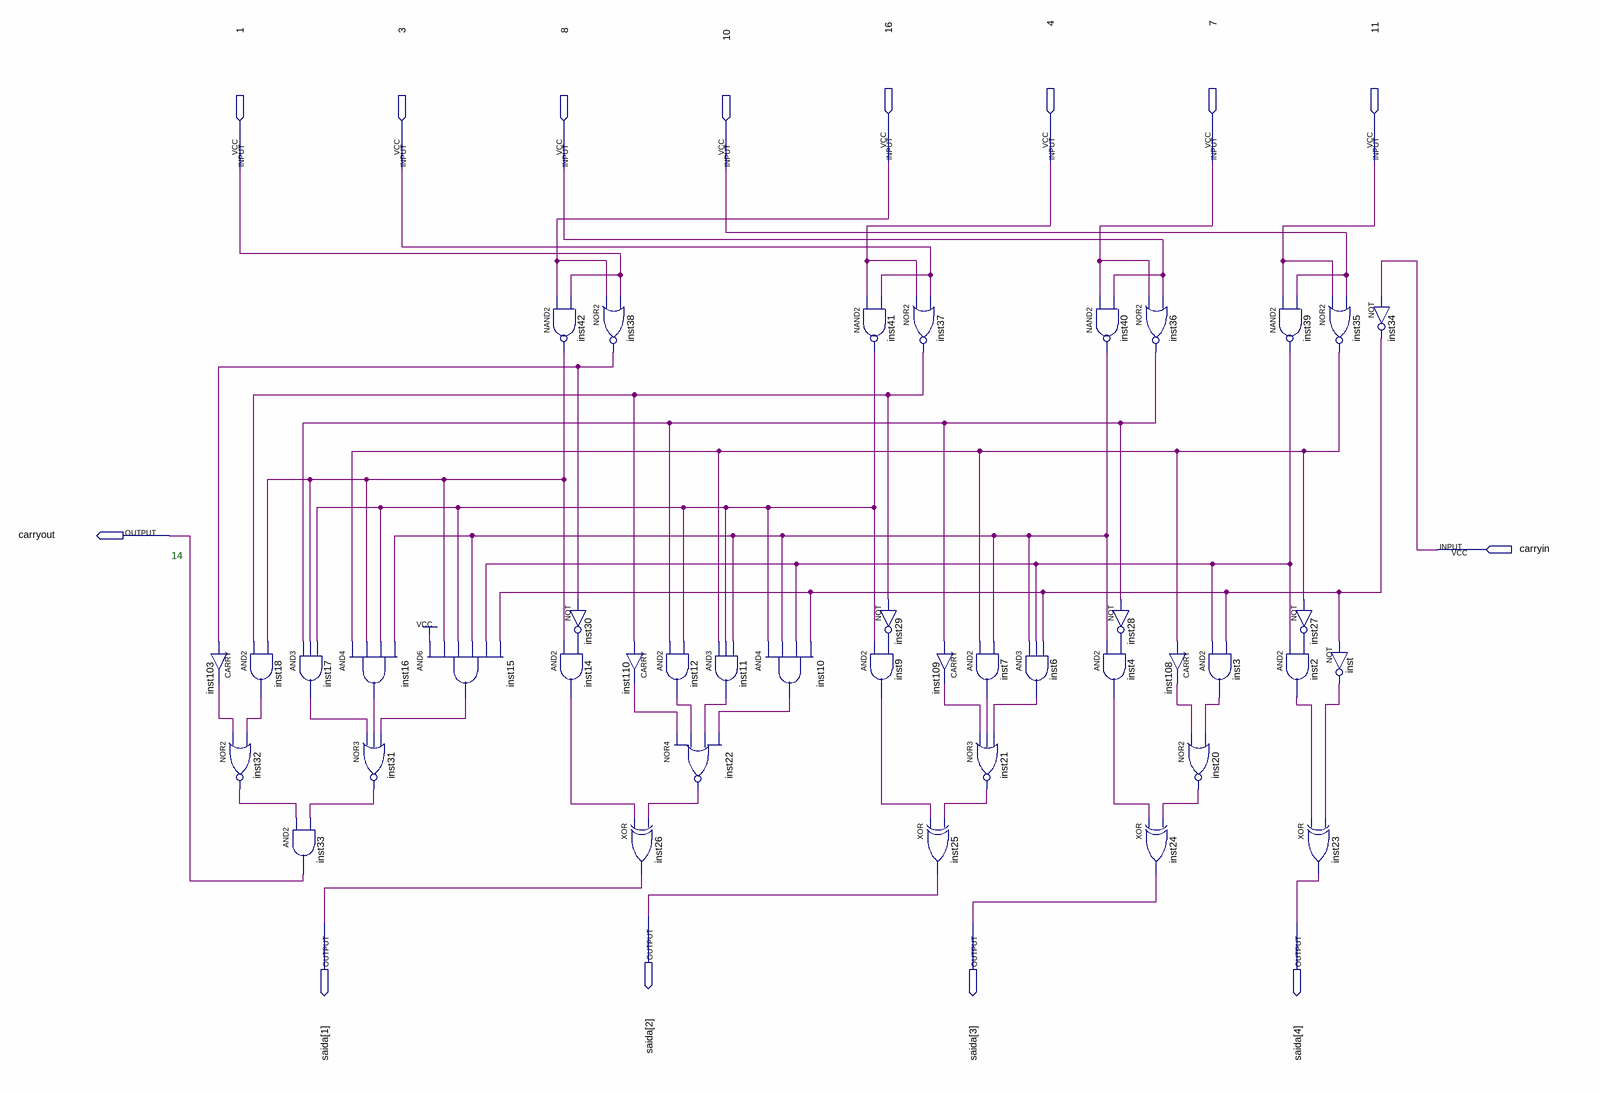
[diagram p0: schematic sheet]
// Quartus schematic adder.bdf as structural Verilog: 42 symbols, 14 pins
module adder (
  input  \16 ,
  input  \4 ,
  input  \7 ,
  input  \11 ,
  input  \1 ,
  input  \3 ,
  input  \8 ,
  input  \10 ,
  input  carryin,
  output carryout,
  output [4:1] saida
);

  wire inst2_out, inst3_out, inst4_out, inst6_out, inst7_out, inst9_out, inst10_out, inst11_out, inst12_out,
       inst14_out, inst15_out, inst16_out, inst17_out, inst18_out, inst20_out, inst21_out, inst22_out,
       inst27_out, inst28_out, inst29_out, inst30_out, inst31_out, inst32_out, inst34_out, inst35_out,
       inst36_out, inst37_out, inst38_out, inst39_out, inst40_out, inst41_out, inst42_out, inst103_out,
       inst108_out, inst109_out, inst110_out, inst_out;

  and inst18 (inst18_out, inst37_out, inst42_out);
  CARRY inst103 (.IN(inst38_out), .OUT(inst103_out));
  nor inst32 (inst32_out, inst103_out, inst18_out);
  and inst17 (inst17_out, inst36_out, inst42_out, inst41_out);
  and inst33 (carryout, inst32_out, inst31_out);
  and inst16 (inst16_out, inst35_out, inst42_out, inst41_out, inst40_out);
  nor inst31 (inst31_out, inst17_out, inst16_out, inst15_out);
  and inst15 (inst15_out, 1'b1, inst42_out, inst41_out, inst40_out, inst39_out, inst34_out);
  nand inst42 (inst42_out, \16 , \1 );
  not inst30 (inst30_out, inst38_out);
  and inst14 (inst14_out, inst42_out, inst30_out);
  nor inst38 (inst38_out, \16 , \1 );
  CARRY inst110 (.IN(inst37_out), .OUT(inst110_out));
  xor inst26 (saida[1], inst14_out, inst22_out);
  and inst12 (inst12_out, inst36_out, inst41_out);
  nor inst22 (inst22_out, inst110_out, inst12_out, inst11_out, inst10_out);
  and inst10 (inst10_out, inst41_out, inst40_out, inst39_out, inst34_out);
  and inst11 (inst11_out, inst35_out, inst41_out, inst40_out);
  nand inst41 (inst41_out, \4 , \3 );
  and inst9 (inst9_out, inst41_out, inst29_out);
  nor inst37 (inst37_out, \4 , \3 );
  not inst29 (inst29_out, inst37_out);
  xor inst25 (saida[2], inst9_out, inst21_out);
  and inst7 (inst7_out, inst35_out, inst40_out);
  CARRY inst109 (.IN(inst36_out), .OUT(inst109_out));
  nor inst21 (inst21_out, inst109_out, inst7_out, inst6_out);
  and inst6 (inst6_out, inst40_out, inst39_out, inst34_out);
  nand inst40 (inst40_out, \7 , \8 );
  and inst4 (inst4_out, inst40_out, inst28_out);
  nor inst36 (inst36_out, \7 , \8 );
  not inst28 (inst28_out, inst36_out);
  xor inst24 (saida[3], inst4_out, inst20_out);
  and inst3 (inst3_out, inst39_out, inst34_out);
  CARRY inst108 (.IN(inst35_out), .OUT(inst108_out));
  nor inst20 (inst20_out, inst108_out, inst3_out);
  nor inst35 (inst35_out, \11 , \10 );
  nand inst39 (inst39_out, \11 , \10 );
  not inst27 (inst27_out, inst35_out);
  and inst2 (inst2_out, inst39_out, inst27_out);
  xor inst23 (saida[4], inst2_out, inst_out);
  not inst34 (inst34_out, carryin);
  not inst (inst_out, inst34_out);

  // Notes on the sheet:
  //   14
endmodule
